# EAGLE schematic STRAIGT_SENSOR_MUX_16 (EAGLE 6.4)
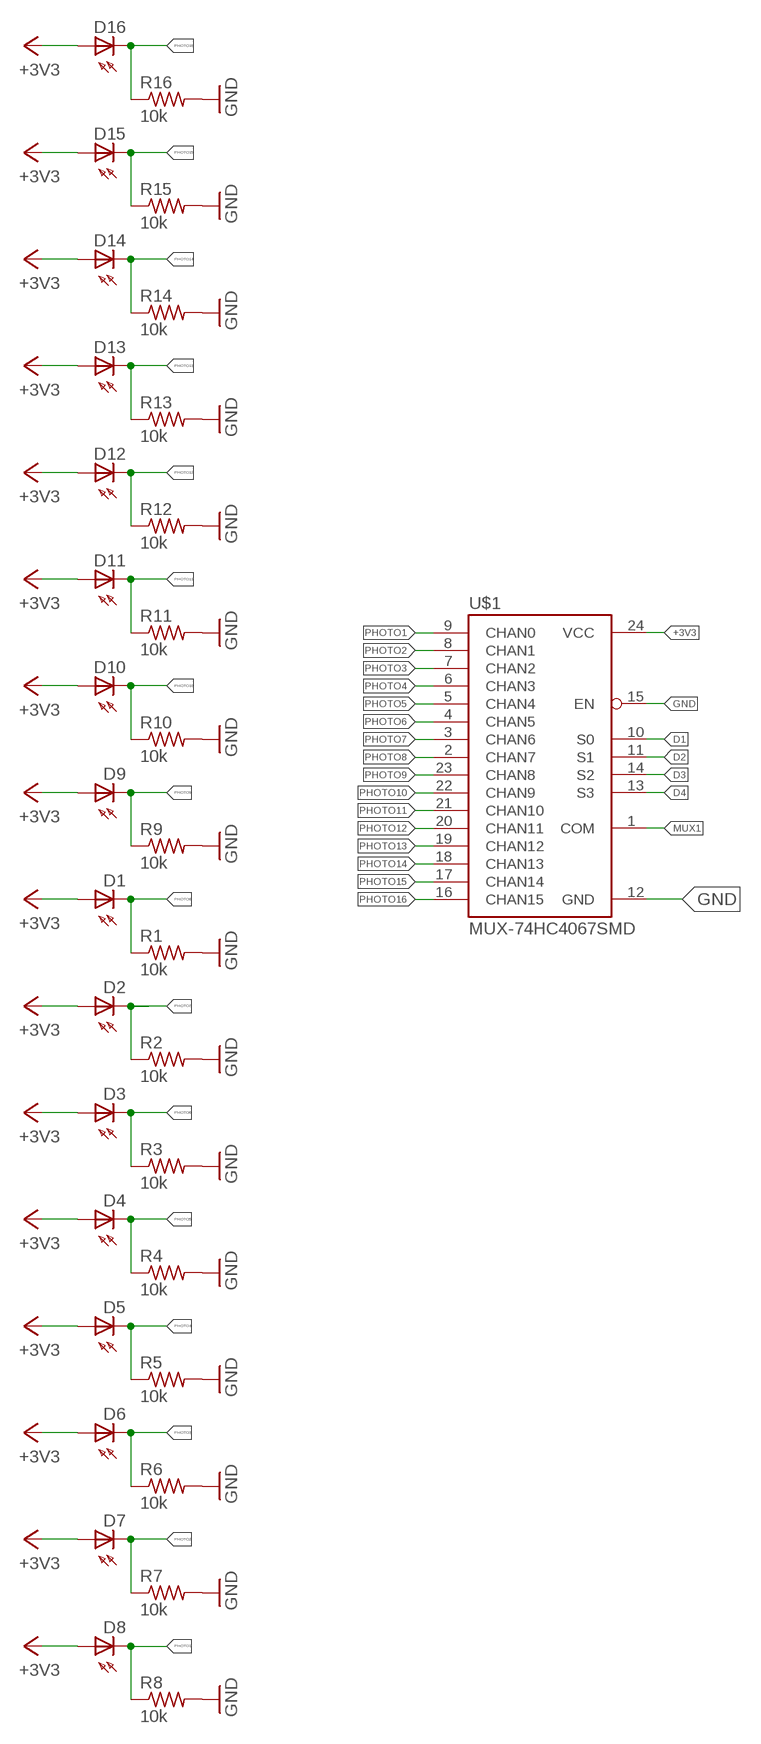
[diagram p0: schematic, sheet 1]

## Parts
D1  Photo0  BPX65  [BPX65]
D2  Photo1  BPX65  [BPX65]
D3  Photo2  BPX65  [BPX65]
D4  Photo3  BPX65  [BPX65]
D5  Photo4  BPX65  [BPX65]
D6  Photo5  BPX65  [BPX65]
D7  Photo6  BPX65  [BPX65]
D8  Photo7  BPX65  [BPX65]
D9  Photo0  BPX65  [BPX65]
D10  Photo0  BPX65  [BPX65]
D11  Photo0  BPX65  [BPX65]
D12  Photo0  BPX65  [BPX65]
D13  Photo0  BPX65  [BPX65]
D14  Photo0  BPX65  [BPX65]
D15  Photo0  BPX65  [BPX65]
D16  Photo0  BPX65  [BPX65]
R1  10k  R-US_0207/10  [0207/10]
R2  10k  R-US_0207/10  [0207/10]
R3  10k  R-US_0207/10  [0207/10]
R4  10k  R-US_0207/10  [0207/10]
R5  10k  R-US_0207/10  [0207/10]
R6  10k  R-US_0207/10  [0207/10]
R7  10k  R-US_0207/10  [0207/10]
R8  10k  R-US_0207/10  [0207/10]
R9  10k  R-US_0207/10  [0207/10]
R10  10k  R-US_0207/10  [0207/10]
R11  10k  R-US_0207/10  [0207/10]
R12  10k  R-US_0207/10  [0207/10]
R13  10k  R-US_0207/10  [0207/10]
R14  10k  R-US_0207/10  [0207/10]
R15  10k  R-US_0207/10  [0207/10]
R16  10k  R-US_0207/10  [0207/10]
U$1  MUX-74HC4067SMD  [SSOP24]

## Nets
+3V3: D1.A D2.A D3.A D4.A D5.A D6.A D7.A D8.A D9.A D10.A D11.A D12.A D13.A D14.A D15.A D16.A U$1.24(VCC)
D1: U$1.10(S0)
D2: U$1.11(S1)
D3: U$1.14(S2)
D4: U$1.13(S3)
GND: R1.2 R2.2 R3.2 R4.2 R5.2 R6.2 R7.2 R8.2 R9.2 R10.2 R11.2 R12.2 R13.2 R14.2 R15.2 R16.2 U$1.12(GND) U$1.15(EN)
MUX1: U$1.1(COM)
PHOTO1: D8.K(C) R8.1 U$1.9(CHAN0)
PHOTO2: D7.K(C) R7.1 U$1.8(CHAN1)
PHOTO3: D6.K(C) R6.1 U$1.7(CHAN2)
PHOTO4: D5.K(C) R5.1 U$1.6(CHAN3)
PHOTO5: D4.K(C) R4.1 U$1.5(CHAN4)
PHOTO6: D3.K(C) R3.1 U$1.4(CHAN5)
PHOTO7: D2.K(C) R2.1 U$1.3(CHAN6)
PHOTO8: D1.K(C) R1.1 U$1.2(CHAN7)
PHOTO9: D9.K(C) R9.1 U$1.23(CHAN8)
PHOTO10: D10.K(C) R10.1 U$1.22(CHAN9)
PHOTO11: D11.K(C) R11.1 U$1.21(CHAN10)
PHOTO12: D12.K(C) R12.1 U$1.20(CHAN11)
PHOTO13: D13.K(C) R13.1 U$1.19(CHAN12)
PHOTO14: D14.K(C) R14.1 U$1.18(CHAN13)
PHOTO15: D15.K(C) R15.1 U$1.17(CHAN14)
PHOTO16: D16.K(C) R16.1 U$1.16(CHAN15)

## Library data of the parts
D1-D16 = opto-trans-siemens:BPX65: PHOTO DIODE; MPN: BPX65.; OC_FARNELL: 327451; OC_NEWARK: 06WX2764
R1-R16 = resistor:R-US_: RESISTOR, American symbol
U$1 = SparkFun-AnalogIC:MUX-74HC4067: 16-channel analog MUX